# EAGLE design bpswitch (EAGLE 9.6.2)
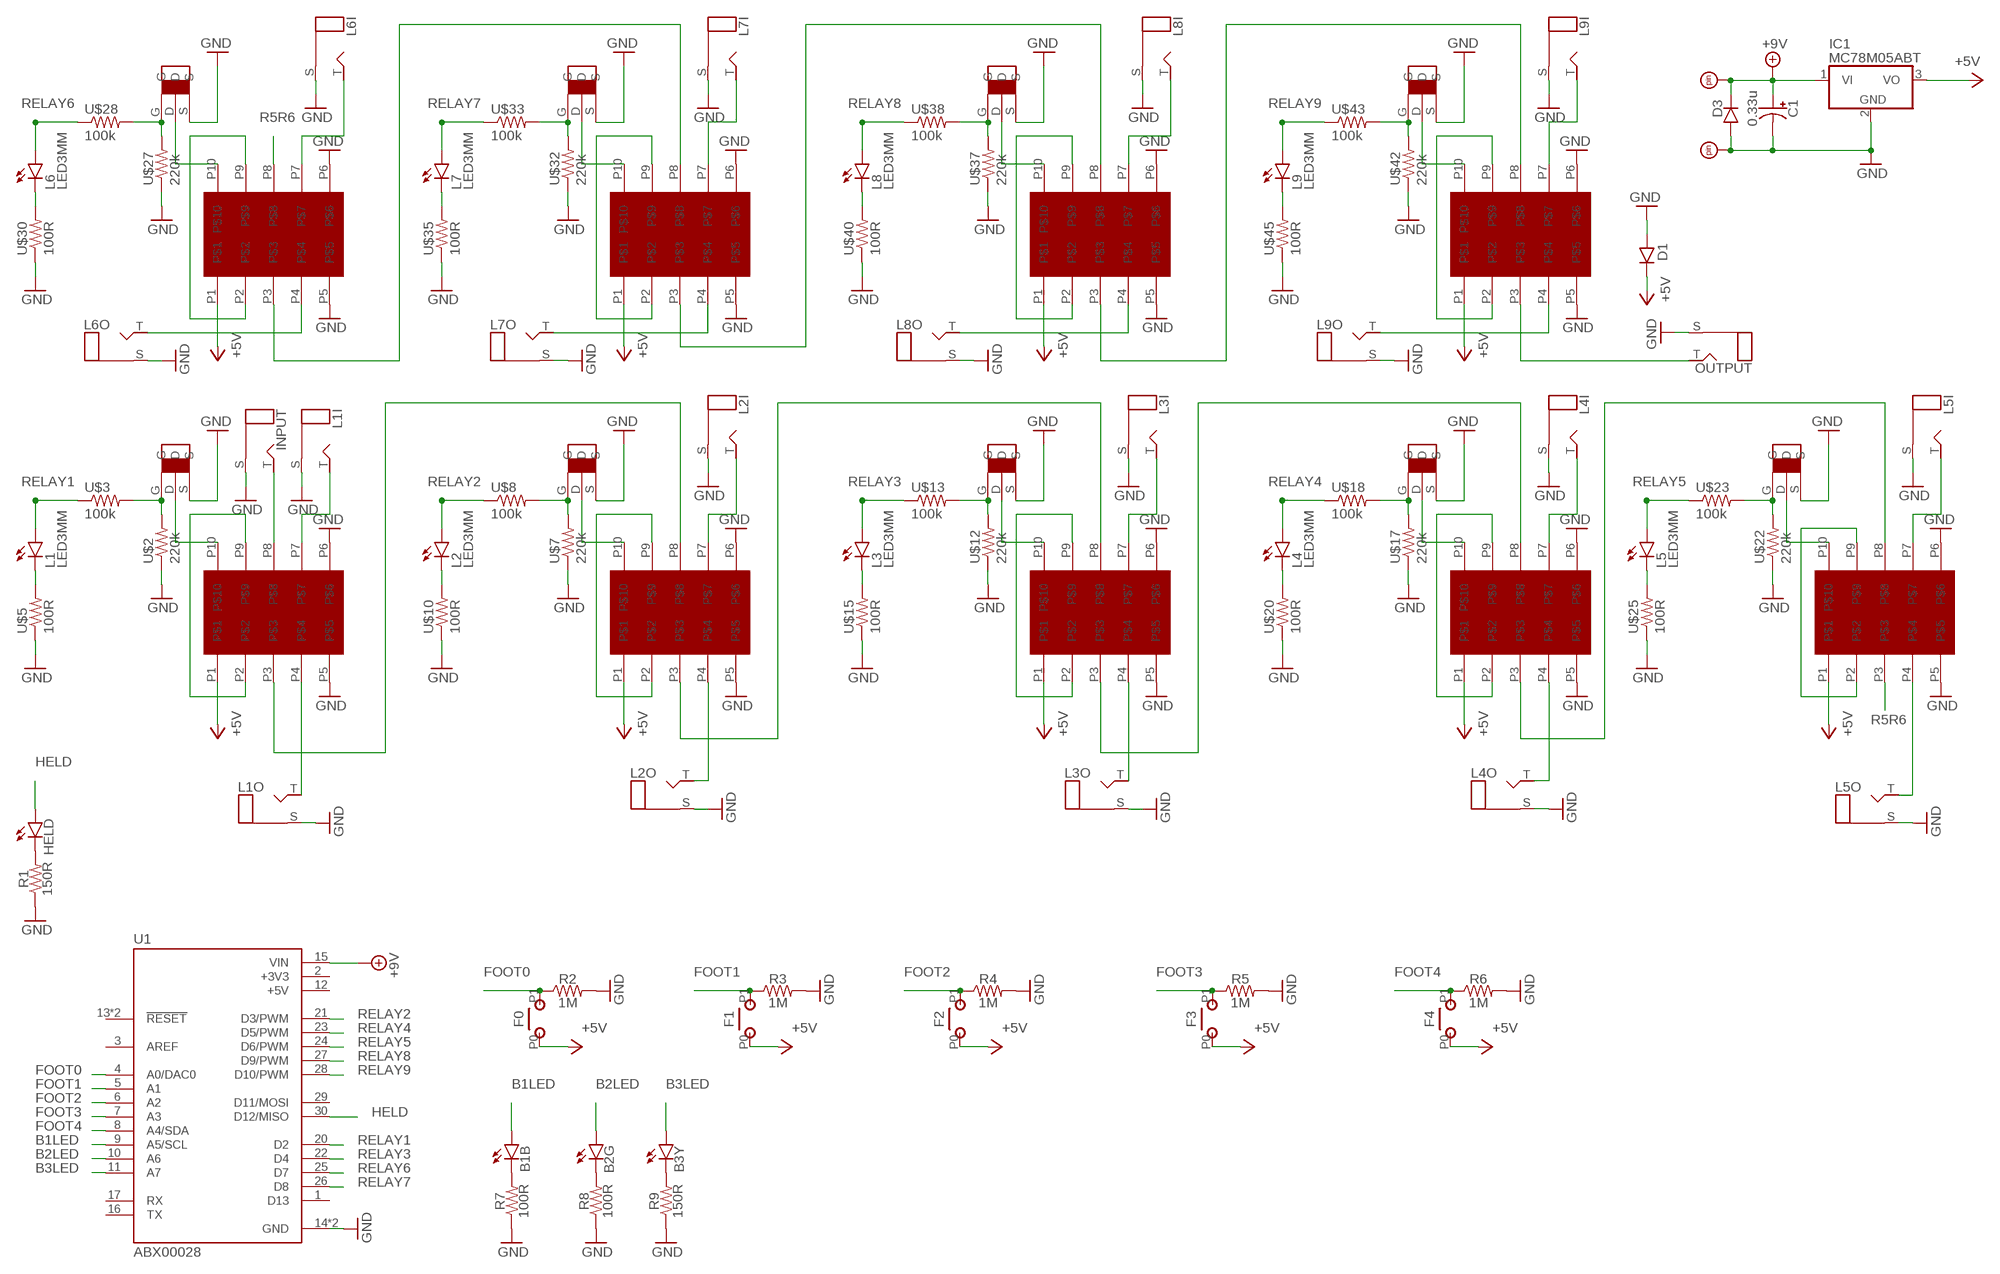
[diagram p0: schematic, sheet 1]

## Parts
B1B  LED.3  [3MM_2]
B2G  LED.3  [3MM_2]
B3Y  LED.3  [3MM_2]
C1  0.33u  5MM.8  [050.FLAT]
D1  1N400X.3  [DO41-3]
D3  DO41.2  [DO41-2]
F0  MOM  [MOM]
F1  MOM  [MOM]
F2  MOM  [MOM]
F3  MOM  [MOM]
F4  MOM  [MOM]
HELD  LED.3  [3MM_2]
IC1  MC78M05ABT  [TO220V]
INPUT  MONO_PADS  [2PADS]
L1  LED3MM  [LED3MM]
L1I  MONO_PADS  [2PADS]
L1O  MONO_PADS  [2PADS]
L2  LED3MM  [LED3MM]
L2I  MONO_PADS  [2PADS]
L2O  MONO_PADS  [2PADS]
L3  LED3MM  [LED3MM]
L3I  MONO_PADS  [2PADS]
L3O  MONO_PADS  [2PADS]
L4  LED3MM  [LED3MM]
L4I  MONO_PADS  [2PADS]
L4O  MONO_PADS  [2PADS]
L5  LED3MM  [LED3MM]
L5I  MONO_PADS  [2PADS]
L5O  MONO_PADS  [2PADS]
L6  LED3MM  [LED3MM]
L6I  MONO_PADS  [2PADS]
L6O  MONO_PADS  [2PADS]
L7  LED3MM  [LED3MM]
L7I  MONO_PADS  [2PADS]
L7O  MONO_PADS  [2PADS]
L8  LED3MM  [LED3MM]
L8I  MONO_PADS  [2PADS]
L8O  MONO_PADS  [2PADS]
L9  LED3MM  [LED3MM]
L9I  MONO_PADS  [2PADS]
L9O  MONO_PADS  [2PADS]
OUTPUT  MONO_PADS  [2PADS]
R1  150R  R.2  [0.2"]
R2  1M  R.2  [0.2"]
R3  1M  R.2  [0.2"]
R4  1M  R.2  [0.2"]
R5  1M  R.2  [0.2"]
R6  1M  R.2  [0.2"]
R7  100R  R.2  [0.2"]
R8  100R  R.2  [0.2"]
R9  150R  R.2  [0.2"]
U1  ABX00028  [MODULE_ABX00028]
U$1  TO-220  [TO-220]
U$2  220k  3MM.2  [R0204/2]
U$3  100k  3MM.2  [R0204/2]
U$4  MINI_RELAY_10PIN  [MINI_RELAY_10PIN]
U$5  100R  3MM.2  [R0204/2]
U$6  TO-220  [TO-220]
U$7  220k  3MM.2  [R0204/2]
U$8  100k  3MM.2  [R0204/2]
U$9  MINI_RELAY_10PIN  [MINI_RELAY_10PIN]
U$10  100R  3MM.2  [R0204/2]
U$11  TO-220  [TO-220]
U$12  220k  3MM.2  [R0204/2]
U$13  100k  3MM.2  [R0204/2]
U$14  MINI_RELAY_10PIN  [MINI_RELAY_10PIN]
U$15  100R  3MM.2  [R0204/2]
U$16  TO-220  [TO-220]
U$17  220k  3MM.2  [R0204/2]
U$18  100k  3MM.2  [R0204/2]
U$19  MINI_RELAY_10PIN  [MINI_RELAY_10PIN]
U$20  100R  3MM.2  [R0204/2]
U$21  TO-220  [TO-220]
U$22  220k  3MM.2  [R0204/2]
U$23  100k  3MM.2  [R0204/2]
U$24  MINI_RELAY_10PIN  [MINI_RELAY_10PIN]
U$25  100R  3MM.2  [R0204/2]
U$26  TO-220  [TO-220]
U$27  220k  3MM.2  [R0204/2]
U$28  100k  3MM.2  [R0204/2]
U$29  MINI_RELAY_10PIN  [MINI_RELAY_10PIN]
U$30  100R  3MM.2  [R0204/2]
U$31  TO-220  [TO-220]
U$32  220k  3MM.2  [R0204/2]
U$33  100k  3MM.2  [R0204/2]
U$34  MINI_RELAY_10PIN  [MINI_RELAY_10PIN]
U$35  100R  3MM.2  [R0204/2]
U$36  TO-220  [TO-220]
U$37  220k  3MM.2  [R0204/2]
U$38  100k  3MM.2  [R0204/2]
U$39  MINI_RELAY_10PIN  [MINI_RELAY_10PIN]
U$40  100R  3MM.2  [R0204/2]
U$41  TO-220  [TO-220]
U$42  220k  3MM.2  [R0204/2]
U$43  100k  3MM.2  [R0204/2]
U$44  MINI_RELAY_10PIN  [MINI_RELAY_10PIN]
U$45  100R  3MM.2  [R0204/2]
VI  PADS.SQR_LBL  [PAD3]
VO  PADS.SQR_LBL  [PAD3]

## Nets
+5V: D1.C F0.P0(P) F1.P0(P) F2.P0(P) F3.P0(P) F4.P0(P) IC1.3(VO) U$4.P1 U$9.P1 U$14.P1 U$19.P1 U$24.P1 U$29.P1 U$34.P1 U$39.P1 U$44.P1
+9V: C1.+ D3.C IC1.1(VI) U1.15(VIN) VI.1
B1LED: B1B.ANODE(A) U1.9(A5/SCL)
B2LED: B2G.ANODE(A) U1.10(A6)
B3LED: B3Y.ANODE(A) U1.11(A7)
FOOT0: F0.P1(S) R2.1 U1.4(A0/DAC0)
FOOT1: F1.P1(S) R3.1 U1.5(A1)
FOOT2: F2.P1(S) R4.1 U1.6(A2)
FOOT3: F3.P1(S) R5.1 U1.7(A3)
FOOT4: F4.P1(S) R6.1 U1.8(A4/SDA)
GND: C1.- D1.A D3.A IC1.2(GND) INPUT.S L1I.S L1O.S L2I.S L2O.S L3I.S L3O.S L4I.S L4O.S L5I.S L5O.S L6I.S L6O.S L7I.S L7O.S L8I.S L8O.S L9I.S L9O.S OUTPUT.S R1.1 R2.2 R3.2 R4.2 R5.2 R6.2 R7.1 R8.1 R9.1 U1.14(GND) U1.19(GND) U$1.S U$2.1 U$4.P5 U$4.P6 U$5.1 U$6.S U$7.1 U$9.P5 U$9.P6 U$10.1 U$11.S U$12.1 U$14.P5 U$14.P6 U$15.1 U$16.S U$17.1 U$19.P5 U$19.P6 U$20.1 U$21.S U$22.1 U$24.P5 U$24.P6 U$25.1 U$26.S U$27.1 U$29.P5 U$29.P6 U$30.1 U$31.S U$32.1 U$34.P5 U$34.P6 U$35.1 U$36.S U$37.1 U$39.P5 U$39.P6 U$40.1 U$41.S U$42.1 U$44.P5 U$44.P6 U$45.1 VO.1
HELD: HELD.ANODE(A) U1.30(D12/MISO)
N$1: U$1.G U$2.2 U$3.2
N$2: U$1.D U$4.P10
N$3: U$6.G U$7.2 U$8.2
N$4: L1.K(C) U$5.2
N$5: U$6.D U$9.P10
N$6: L2.K(C) U$10.2
N$7: U$11.G U$12.2 U$13.2
N$8: U$11.D U$14.P10
N$9: L3.K(C) U$15.2
N$10: U$16.G U$17.2 U$18.2
N$11: U$16.D U$19.P10
N$12: L4.K(C) U$20.2
N$13: U$21.G U$22.2 U$23.2
N$14: U$21.D U$24.P10
N$15: L5.K(C) U$25.2
N$16: U$26.G U$27.2 U$28.2
N$17: U$26.D U$29.P10
N$18: L6.K(C) U$30.2
N$19: U$31.G U$32.2 U$33.2
N$20: U$31.D U$34.P10
N$21: L7.K(C) U$35.2
N$22: U$36.G U$37.2 U$38.2
N$23: U$36.D U$39.P10
N$24: L8.K(C) U$40.2
N$25: U$41.G U$42.2 U$43.2
N$26: U$41.D U$44.P10
N$27: L9.K(C) U$45.2
N$28: U$4.P2 U$4.P9
N$29: U$9.P2 U$9.P9
N$30: U$14.P2 U$14.P9
N$31: U$19.P2 U$19.P9
N$32: U$24.P2 U$24.P9
N$33: U$44.P2 U$44.P9
N$34: U$39.P2 U$39.P9
N$35: U$34.P2 U$34.P9
N$36: U$29.P2 U$29.P9
N$37: U$4.P3 U$9.P8
N$38: U$9.P3 U$14.P8
N$39: U$14.P3 U$19.P8
N$40: U$19.P3 U$24.P8
N$41: U$29.P3 U$34.P8
N$42: U$34.P3 U$39.P8
N$43: U$39.P3 U$44.P8
N$44: L1I.T U$4.P7
N$45: INPUT.T U$4.P8
N$46: L1O.T U$4.P4
N$47: L6O.T U$29.P4
N$48: L6I.T U$29.P7
N$49: L7O.T U$34.P4
N$50: L7I.T U$34.P7
N$51: L8O.T U$39.P4
N$52: L8I.T U$39.P7
N$53: L9I.T U$44.P7
N$54: L9O.T U$44.P4
N$55: OUTPUT.T U$44.P3
N$56: L5I.T U$24.P7
N$57: L5O.T U$24.P4
N$58: L4O.T U$19.P4
N$59: L3O.T U$14.P4
N$60: L3I.T U$14.P7
N$61: L2I.T U$9.P7
N$62: L2O.T U$9.P4
N$63: L4I.T U$19.P7
N$64: HELD.P$1(C) R1.2
N$65: B1B.P$1(C) R7.2
N$66: B2G.P$1(C) R8.2
N$67: B3Y.P$1(C) R9.2
R5R6: U$24.P3 U$29.P8
RELAY1: L1.A U1.20(D2) U$3.1
RELAY2: L2.A U1.21(D3/PWM) U$8.1
RELAY3: L3.A U1.22(D4) U$13.1
RELAY4: L4.A U1.23(D5/PWM) U$18.1
RELAY5: L5.A U1.24(D6/PWM) U$23.1
RELAY6: L6.A U1.25(D7) U$28.1
RELAY7: L7.A U1.26(D8) U$33.1
RELAY8: L8.A U1.27(D9/PWM) U$38.1
RELAY9: L9.A U1.28(D10/PWM) U$43.1
Unconnected: U1.1(D13) U1.3(AREF) U1.13(!RESET) U1.16(TX) U1.17(RX) U1.18(!RESET) U1.29(D11/MOSI)

## Power pins joined to a net without a drawn wire
+3V3: U1.2(+3V3)
+5V: U1.12(+5V)

## Library data of the parts
B1B B2G B3Y HELD = diodes:LED: LEDs, all sizes 3mm: http://smallbear-electronics.mybigcommerce.com/led-t-1-3mm-diffused-colors/ 5mm: http://smallbear-electronics.mybigcommerce.com/led-t-1-3-4-5mm-diffused/
C1 = caps-elec:5MM: 5mm diameter caps Up to 47uF
D1 = gm-diodes:1N400X: Rectifier Diodes often used in power supply to prevent damage from reverse polarization
D3 = diodes:DO41: 1N400x, 1N5817 Standard and Schottky Rectifiers, DO-41 Package 1N4001: http://smallbear-electronics.mybigcommerce.com/diode-1n4001/ 1N5817: http://www.mouser.com/ProductDetail/Fairchild-Semiconductor/1N5817/?qs=sGAEpiMZZMtQ8nqTKtFS%2fCJFZUIIOyzjWJhH2RQmKoY%3d
F0 F1-F4 = dlibland:MOM
IC1 = linear:MC78M: 500 mA Positive Voltage Regulators Source: Data sheet <http://www.onsemi.com/pub_link/Collateral/MC78M00-D.PDF>
INPUT L1I L1O L2I L2O L3I L3O L4I L4O L5I L5O L6I L6O L7I L7O L8I L8O L9I L9O OUTPUT = jacks:MONO: Mono 1/4" TS Jack and wiring connections Marshall style (PCB Mount): http://smallbear-electronics.mybigcommerce.com/1-4-enclosed-nmj4hcd2/ Lumberg Mono (wired): http://smallbear-electronics.mybigcommerce.com/lumberg-1-4-compact-shrouded-mono-jack/
L1-L9 = gm-diodes:LED
R1-R9 = resistors:R: 1/8W, 1/4W and 1W resistors
U1 = ABX00028:ABX00028: ATmega4809 Arduino Nano Every AVR AVR MCU 8-Bit Embedded Evaluation Board; DESCRIPTION: Arduino’s 5V compatible board in the smallest available form factor: 45x18mm!; MF: Arduino; MP: Arduino Nano Every; PACKAGE: None; PURCHASE-URL: https://pricing.snapeda.com/search/part/Arduino Nano Every/?ref=eda
U$1 U$6 U$11 U$16 U$21 U$26 U$31 U$36 U$41 = dlibland:TO-220
U$2 U$3 U$5 U$7 U$8 U$10 U$12 U$13 U$15 U$17 U$18 U$20 U$22 U$23 U$25 U$27 U$28 U$30 U$32 U$33 U$35 U$37 U$38 U$40 U$42 U$43 U$45 = gm-resistors:3MM: 3mm Resistors Leads spaced 1-6 holes apart for 0.1" perfboard. Suitable for 1/8 watt resistors.
U$4 U$9 U$14 U$19 U$24 U$29 U$34 U$39 U$44 = dlibland:MINI_RELAY_10PIN
VI VO = supply pins:PADS.: Pads For I/O connections or test point pads on PCBs.

## Board
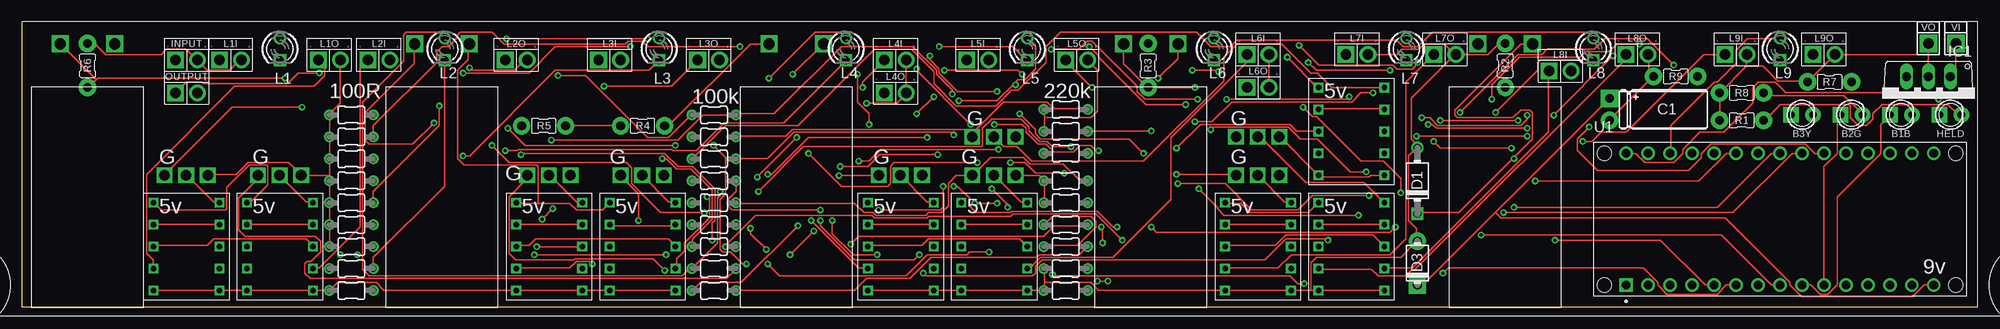
[diagram p1: board, top side]
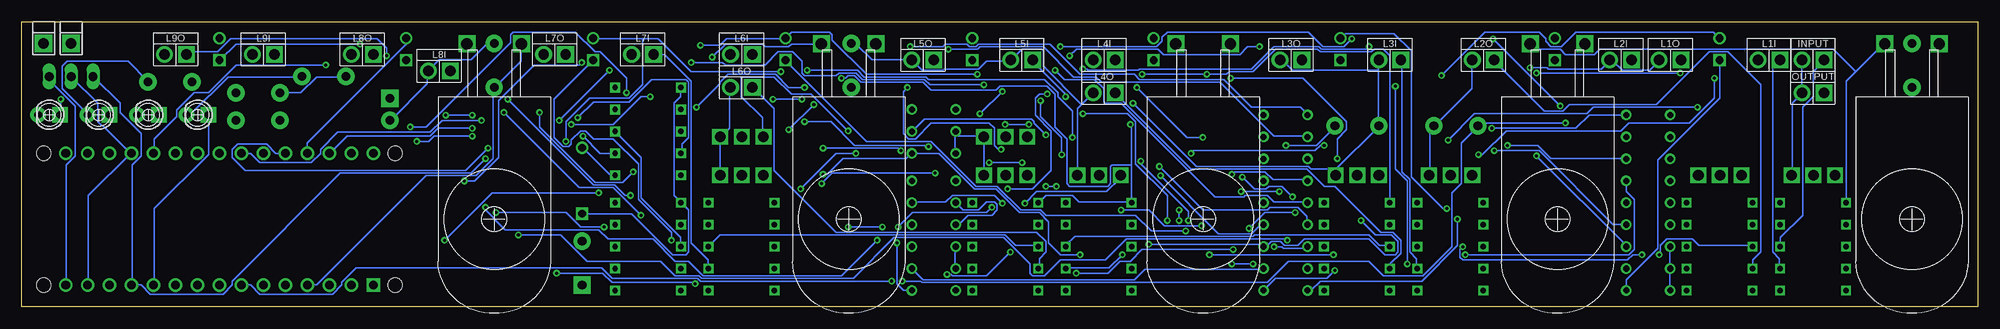
[diagram p2: board, bottom side, seen from below]

Size 226.06 x 33.02 mm. Coordinates in mm from the lower left corner, seen from the top.
Outline: 0,0 226.06,0 226.06,33.02 0,33.02 0,0
Copper layers (1*16): Top 0.035mm / dielectric 1.5mm / Bottom 0.035mm
Design rules "default": minimum track width 6mil, minimum drill 0.35mm, track to track 6mil, track to pad 6mil, pad to pad 6mil, via to via 6mil, smd to smd 6mil, copper to edge 40mil, drill to drill 6mil, minimum pad ring 10mil, minimum via ring 8mil, stop-mask expansion 4mil, vias tented up to drill 0mil, thermal gap 10mil

### Footprints (pad centres in the part's own frame; a part is rotated, then mirrored left to right if it is on the bottom)
3MM_2 = drill 0.9 pad 1.778 square: ANODE -1.27,0 | drill 0.9 pad 1.778: P$1 1.27,0
050.FLAT = drill 1 pad 2 square: + -5.08,1.27 | drill 1 pad 2: - -5.08,-1.27
DO41-3 = drill 0.9: A 3.81,0 | drill 0.9 square: C -3.81,0
DO41-2 = drill 1 pad 2: A 2.54,0 | drill 1 pad 2 square: C -2.54,0
MOM = drill 1.3 square: P0 -3.15,-17.75; P1 3.15,-17.75
TO220V = drill 1.016 long: 1 -2.54,-2.54; 2 0,-2.54; 3 2.54,-2.54
2PADS = drill 1.2 pad 1.93: S 1.27,0 | drill 1.2 pad 1.93 square: T -1.27,0
LED3MM = drill 0.9: A -1.27,0 | drill 0.9 square: K 1.27,0
0.2" = drill 1 pad 2: 1 -2.54,0; 2 2.54,0
MODULE_ABX00028 = drill 1.016 square: 1 -17.78,-7.62 | drill 1.016: 2 -15.24,-7.62; 3 -12.7,-7.62; 4 -10.16,-7.62; 5 -7.62,-7.62; 6 -5.08,-7.62; 7 -2.54,-7.62; 8 0,-7.62; 9 2.54,-7.62; 10 5.08,-7.62; 11 7.62,-7.62; 12 10.16,-7.62; 13 12.7,-7.62; 14 15.24,-7.62; 15 17.78,-7.62; 16 17.78,7.62; 17 15.24,7.62; 18 12.7,7.62; 19 10.16,7.62; 20 7.62,7.62; 21 5.08,7.62; 22 2.54,7.62; 23 0,7.62; 24 -2.54,7.62; 25 -5.08,7.62; 26 -7.62,7.62; 27 -10.16,7.62; 28 -12.7,7.62; 29 -15.24,7.62; 30 -17.78,7.62 | hole 1.651: -20.32,-7.62; -20.32,7.62; 20.32,7.62; 20.32,-7.62
TO-220 = drill 1.219 square: D -0.04,0; G -2.54,0; S 2.46,0
R0204/2 = drill 0.7: 1 -2.54,0; 2 2.54,0
MINI_RELAY_10PIN = drill 0.635 square: P1 -3.81,5.08; P2 -3.81,2.54; P3 -3.81,0; P4 -3.81,-2.54; P5 -3.81,-5.08; P6 3.81,-5.08; P7 3.81,-2.54; P8 3.81,0; P9 3.81,2.54; P10 3.81,5.08
PAD3 = drill 1.2 pad 2.032 square: 1 0,0

### Placement (x,y rotation side)
B1B  217.17,22.23 0 top
B2G  211.45,22.23 0 top
B3Y  205.74,22.23 0 top
C1  188.59,22.86 0 top
D1  161.29,14.61 90 top
D3  161.29,5.08 90 top
F0  171.45,12.7 180 top
F1  130.49,12.7 180 top
F2  89.53,12.7 180 top
F3  48.58,12.7 180 top
F4  7.62,12.7 180 top
HELD  222.88,22.23 0 top
IC1  220.34,24.13 180 top
INPUT  19.05,28.57 0 top
L1  29.84,29.85 270 top
L1I  24.13,28.57 0 top
L1O  35.56,28.57 0 top
L2  48.89,29.85 270 top
L2I  41.28,28.57 0 top
L2O  57.15,28.57 0 top
L3  73.66,29.85 270 top
L3I  67.94,28.57 0 top
L3O  79.38,28.57 0 top
L4  95.25,29.85 270 top
L4I  100.97,28.57 0 top
L4O  100.97,24.77 0 top
L5  116.2,29.85 270 top
L5I  110.49,28.57 0 top
L5O  121.92,28.57 0 top
L6  137.8,29.85 270 top
L6I  142.88,29.21 0 top
L6O  142.88,25.4 0 top
L7  160.02,29.85 270 top
L7I  154.31,29.21 0 top
L7O  164.47,29.21 0 top
L8  181.61,29.85 270 top
L8I  177.8,27.3 0 top
L8O  186.69,29.21 0 top
L9  203.2,29.85 270 top
L9I  198.12,29.21 0 top
L9O  208.28,29.21 0 top
OUTPUT  19.05,24.77 0 top
R1  198.75,21.59 0 top
R2  171.45,27.94 90 top
R3  130.18,27.94 90 top
R4  71.75,20.95 180 top
R5  60.33,20.95 0 top
R6  7.62,27.94 90 top
R7  208.92,26.04 0 top
R8  198.75,24.77 0 top
R9  191.13,26.67 0 top
U1  203.2,10.16 0 top
U$1  19.05,15.24 0 top
U$2  120.65,1.91 0 top
U$3  80.01,22.23 0 top
U$4  19.05,6.98 0 top
U$5  38.1,1.91 0 top
U$6  29.84,15.24 0 top
U$7  120.65,4.45 0 top
U$8  80.01,4.45 0 top
U$9  29.84,6.98 0 top
U$10  38.1,4.45 0 top
U$11  60.96,15.24 0 top
U$12  120.65,6.98 0 top
U$13  80.01,1.91 0 top
U$14  60.96,6.98 0 top
U$15  38.1,6.98 0 top
U$16  71.75,15.24 0 top
U$17  120.65,9.53 0 top
U$18  80.01,6.98 0 top
U$19  71.75,6.98 0 top
U$20  38.1,9.53 0 top
U$21  101.6,15.24 0 top
U$22  120.65,12.07 0 top
U$23  80.01,9.53 0 top
U$24  101.6,6.98 0 top
U$25  38.1,12.07 0 top
U$26  112.39,15.24 0 top
U$27  120.65,14.61 0 top
U$28  80.01,12.07 0 top
U$29  112.39,6.98 0 top
U$30  38.1,14.61 0 top
U$31  142.88,15.24 0 top
U$32  120.65,17.78 0 top
U$33  80.01,14.61 0 top
U$34  142.88,6.98 0 top
U$35  38.1,17.15 0 top
U$36  142.88,19.69 0 top
U$37  120.65,20.32 0 top
U$38  80.01,17.15 0 top
U$39  153.67,6.98 0 top
U$40  38.1,19.69 0 top
U$41  112.39,19.69 0 top
U$42  120.65,22.86 0 top
U$43  80.01,19.69 0 top
U$44  153.67,20.32 0 top
U$45  38.1,22.23 0 top
U$46  [1032L]  113.03,29.21 0 top
U$47  [LUMBURG_TOP]  29.36,58.42 0 bottom  (outside the outline)
U$48  [LUMBURG_TOP]  203.2,58.42 0 bottom  (outside the outline)
U$49  [LUMBURG_TOP]  159.74,58.42 0 bottom  (outside the outline)
U$50  [LUMBURG_TOP]  138,58.42 0 bottom  (outside the outline)
U$51  [LUMBURG_TOP]  116.28,58.42 0 bottom  (outside the outline)
U$52  [LUMBURG_TOP]  94.54,58.42 0 bottom  (outside the outline)
U$53  [LUMBURG_TOP]  72.82,58.42 0 bottom  (outside the outline)
U$54  [LUMBURG_TOP]  51.1,58.42 0 bottom  (outside the outline)
U$55  [LUMBURG_TOP]  7.62,58.42 0 bottom  (outside the outline)
U$56  [DC_TOP]  219.71,63.5 0 top  (outside the outline)
U$57  [LUMBURG_TOP]  181.48,58.42 0 bottom  (outside the outline)
U$58  [MOMENTARY]  171.45,10.16 270 top
U$59  [MOMENTARY]  130.49,10.16 270 top
U$60  [MOMENTARY]  89.53,10.16 270 top
U$61  [MOMENTARY]  48.58,10.16 270 top
U$62  [MOMENTARY]  7.62,10.16 270 top
VI  223.52,30.48 180 top
VO  220.34,30.48 180 top

### Tracks (layer width: path | path; a pad name or v marks a point on that pad's centre or on a via)
+5V  (via drill 0.35)
  Top 0.152: U$34.P1 139.09,11.99 140.92,11.99 141.99,10.92 148.69,10.92 149.76,11.99 U$39.P1 | v146.25,28.91 149.76,25.4 U$44.P1 | 172.31,17.17 166.06,10.92 161.34,10.92 D1.C | 172.31,17.17 174.6,19.46 174.6,22.5 174.3,22.81 173.23,22.81 172.31,21.89 165.91,21.89 165.61,22.2 165.61,22.81 173.23,30.43 174.6,30.43 F0.P0 | 172.31,17.17 v172.47,17.17 | U$9.P1 26.16,12.14 26.47,12.14 28.45,14.12 28.45,16.26 28.3,16.41 26.31,16.41 23.72,13.82 23.72,11.38 23.57,11.23 16.1,11.23 15.34,11.99 U$4.P1 | 59.69,11.99 63.35,11.99 64.11,11.23 67.16,11.23 67.92,11.99 U$19.P1 | 59.69,11.99 57.25,11.99 U$14.P1 | 59.69,11.99 59.69,16.26 59.54,16.41 51.16,16.41 50.39,17.17 50.39,27.38 51.61,28.6 51.61,30.43 F3.P0 | v89.1,26.92 92.61,30.43 F2.P0 | v97.94,21.13 97.94,22.35 96.57,23.72 v96.57,26.92 | v131.32,26.47 133.6,28.75 133.6,30.43 F1.P0
  Bottom 0.152: 213.31,2.54 213.31,16.41 212.24,17.48 212.24,20.07 214.68,22.5 214.68,23.57 217.73,26.62 IC1.3 | U$44.P1 149.91,25.4 149.91,24.33 150.67,23.57 150.67,12.9 149.91,12.14 U$39.P1 149.76,11.99 149,11.23 149,6.35 149.3,6.05 150.82,6.05 155.55,10.77 161.19,10.77 D1.C | v146.25,28.91 144.73,30.43 140.46,30.43 140.16,30.12 137.41,30.12 137.11,30.43 133.76,30.43 F1.P0 | 213.31,2.54 212.24,2.54 211.18,1.47 202.79,1.47 201.73,2.54 201.73,3 189.23,15.49 174.14,15.49 v172.47,17.17 | 213.31,2.54 U1.12 | 14.12,27.23 10.92,30.43 F4.P0 | 14.12,27.23 15.19,26.16 15.19,12.14 U$4.P1 | 97.79,12.14 103.89,12.14 104.65,12.9 107.7,12.9 108.46,12.14 U$29.P1 | U$19.P1 67.92,12.14 67.92,29.06 68.68,29.82 69.75,29.82 70.05,29.52 76,29.52 76.3,29.82 81.18,29.82 83.77,27.23 86.51,27.23 86.82,26.92 v89.1,26.92 v96.57,26.92 | 97.79,16.41 97.79,20.98 v97.94,21.13 | 97.79,16.41 97.79,12.14 | 97.79,12.14 U$24.P1 | 14.12,27.23 16.71,29.82 43.69,29.82 44.3,29.21 47.65,29.21 48.26,29.82 51,29.82 51.61,30.43 F3.P0 | v131.32,26.47 130.86,26.47 130.56,26.77 129.79,26.77 129.03,26.01 121.87,26.01 120.95,25.09 113.49,25.09 113.03,25.55 107.54,25.55 106.63,24.64 106.63,20.83 105.26,19.46 105.26,14.28 104.95,13.97 100.53,13.97 100.23,14.28 100.23,16.26 100.08,16.41 97.79,16.41
+9V
  Top 0.152: VI.1 223.52,27.38 222.91,26.77 IC1.1 | D3.C 161.95,2.54 170.33,10.92 | 170.33,10.92 183.44,24.03 C1.+ | U1.15 219.86,2.54 218.49,1.17 205.69,1.17 204.32,2.54 204.32,2.85 196.85,10.31 170.94,10.31 170.33,10.92
  Bottom 0.152: U1.15 220.93,2.54 220.93,16.41 219.86,17.48 219.86,23.27 222.76,26.16 222.76,26.62 IC1.1
B1LED
  Top 0.152: U1.9 206.76,2.54 207.82,1.47 208.74,1.47 209.8,2.54 209.8,12.75 214.83,17.78 214.83,21.13 215.9,22.2 B1B.ANODE
B2LED
  Top 0.152: U1.10 208.28,16.26 209.8,17.78 209.8,21.89 210.11,22.2 B2G.ANODE
B3LED
  Bottom 0.152: B3Y.ANODE 204.47,17.63 210.72,11.38 210.72,2.54 U1.11
FOOT0
  Bottom 0.152: U1.4 191.97,2.54 179.32,15.19 173.53,15.19 171.55,17.17 171.55,25.4 R2.1 171.4,25.4 168.35,28.45 168.35,30.43 F0.P1
FOOT1  (via drill 0.35)
  Top 0.152: U1.5 194.56,2.54 189.38,7.72 v177.19,7.72 | v159.36,13.21 159.36,14.88 157.38,16.87 154.79,16.87 149.61,22.05 149.15,22.05 v148.08,23.11 | v135.59,25.4 R3.1 130.1,25.4 127.36,28.14 127.36,30.43 F1.P1
  Bottom 0.152: v177.19,7.72 171.7,13.21 v159.36,13.21 | v148.08,23.11 145.34,25.86 145.34,26.01 144.42,26.92 138.94,26.92 137.41,25.4 v135.59,25.4
FOOT2  (via drill 0.35)
  Top 0.152: U1.6 197,2.54 195.94,1.47 190.14,1.47 189.08,2.54 189.08,2.85 187.4,4.52 164.85,4.52 v164.24,3.91 | v148.23,2.69 147.47,2.69 146.56,3.61 119.28,3.61 v119.13,3.76 | v111.81,6.35 109.53,6.35 109.22,6.05 104.65,6.05 102.21,3.61 87.58,3.61 v86.21,4.98 | v83.77,4.98 83.31,4.98 81.94,6.35 81.03,6.35 80.72,6.66 80.72,12.45 81.33,13.06 81.33,17.32 v79.96,18.69 | F2.P1 86.36,30.43 84.23,30.43 74.78,20.98 74.32,20.98 R4.1
  Bottom 0.152: v164.24,3.91 158.9,3.91 157.84,2.85 148.39,2.85 v148.23,2.69 | v119.13,3.76 118.67,3.76 118.52,3.61 114.55,3.61 v111.81,6.35 | v83.77,4.98 v86.21,4.98 | v79.96,18.69 76.45,18.69 74.32,20.83 R4.1
FOOT3  (via drill 0.35)
  Top 0.152: v124.31,3 v125.53,3 | v47.65,21.29 45.21,18.85 40.18,18.85 39.73,19.3 39.73,22.5 45.36,28.14 45.36,30.43 F3.P1
  Bottom 0.152: U1.7 199.59,2.54 198.53,1.47 190.14,1.47 189.08,2.54 189.08,2.85 187.4,4.52 159.06,4.52 157.84,3.3 147.93,3.3 147.62,3 v125.53,3 | v124.31,3 122.17,3 122.02,2.85 82.09,2.85 79.65,5.28 70.36,5.28 68.68,3.61 64.11,3.61 60.76,6.96 60.76,13.21 59.69,14.28 59.69,19 57.86,20.83 R5.1 57.71,20.98 57.4,21.29 v47.65,21.29
FOOT4  (via drill 0.35)
  Top 0.152: U1.8 202.18,2.54 196.39,8.33 v168.66,8.33 | v79.81,7.72 79.81,9.7 80.11,10.01 80.11,13.67 77.52,16.26 75.84,16.26 74.32,17.78 57.86,17.78 v57.71,17.63 | v30.43,26.47 8.79,26.47 8.64,26.31 | 8.64,26.31 7.72,25.4 R6.1 | 8.64,26.31 4.52,30.43 F4.P1
  Bottom 0.152: v168.66,8.33 163.78,8.33 160.73,5.28 152.2,5.28 150.52,3.61 147.78,3.61 147.47,3.3 129.95,3.3 125.22,8.03 112.57,8.03 109.53,4.98 109.53,3.91 109.22,3.61 107.85,3.61 106.02,5.44 100.84,5.44 98.4,7.87 79.96,7.87 v79.81,7.72 | v57.71,17.63 57.25,17.63 54.51,20.37 41.25,20.37 40.34,21.29 33.33,21.29 30.43,24.18 v30.43,26.47
GND  (via drill 0.35)
  Top 0.152: R5.2 62.89,20.98 69.14,20.98 R4.2 | L1I.S 25.4,28.45 25.09,28.45 24.03,27.38 21.44,27.38 20.37,28.45 INPUT.S 20.22,28.6 19,29.82 16.71,29.82 16.1,29.21 9.7,29.21 8.48,30.43 7.72,30.43 R6.2 | U$19.P6 75.54,1.93 68.07,1.93 U$19.P5 67.92,1.93 64.87,1.93 U$14.P6 64.72,1.93 57.25,1.93 U$14.P5 57.1,1.93 41.86,1.93 40.95,2.85 36.53,2.85 35.61,1.93 U$5.1 35.46,1.93 33.78,1.93 U$9.P6 33.63,1.93 26.16,1.93 U$9.P5 26.01,1.93 22.96,1.93 U$4.P6 22.81,1.93 15.34,1.93 U$4.P5 | U$15.1 35.61,7.11 35.61,9.4 U$20.1 35.61,9.55 35.61,11.99 U$25.1 35.61,12.14 35.61,14.58 U$30.1 | 35.61,15.19 35.61,14.73 U$30.1 | 35.61,15.19 35.61,17.02 U$35.1 35.61,17.17 35.61,19.61 U$40.1 35.61,19.76 35.61,22.2 U$45.1 35.61,22.35 36.83,23.57 L1O.S | 35.61,15.19 32.41,15.19 U$6.S 32.26,15.34 30.89,16.71 26.16,16.71 24.79,15.34 21.59,15.34 U$1.S | 35.61,15.19 U$30.1 | v51.77,27.69 52.07,27.38 56.95,27.38 58.01,28.45 58.32,28.45 L2O.S | 118.21,2.85 118.21,4.37 U$7.1 | 118.21,2.85 118.21,1.93 U$2.1 118.06,1.93 116.23,1.93 U$29.P6 116.08,1.93 108.61,1.93 U$29.P5 108.46,1.93 105.41,1.93 | 105.41,1.93 97.79,1.93 U$24.P5 | 105.41,1.93 U$24.P6 | L4I.S 102.21,28.45 102.21,24.79 L4O.S 102.21,24.64 101.14,23.57 v97.64,23.57 | 118.21,21.89 118.21,20.37 U$37.1 | 118.21,21.89 118.21,22.81 U$42.1 | U$22.1 118.21,12.14 118.21,14.58 U$27.1 118.06,14.73 117.6,15.19 114.86,15.19 U$26.S | 118.21,21.89 123.55,21.89 124.31,22.66 124.31,27.38 123.24,28.45 L5O.S | U$12.1 118.21,7.11 122.02,7.11 124.16,9.25 124.16,9.86 123.55,10.46 119.13,10.46 118.21,9.55 U$17.1 | 149,1.93 146.71,1.93 U$34.P6 146.56,1.93 139.09,1.93 U$34.P5 138.94,1.93 124.46,1.93 123.55,2.85 118.21,2.85
  Top 0.152: 149,1.93 149.76,1.93 U$39.P5 149.91,1.93 157.38,1.93 U$39.P6 | L6O.S 144.12,25.4 144.12,29.21 L6I.S | U$36.S 145.34,19.76 U$44.P5 150.06,15.04 155.7,15.04 155.85,15.19 157.38,15.19 U$44.P6 | 149,1.93 149,5.13 149.61,5.74 159.36,5.74 161.19,7.57 D3.A 161.19,7.72 161.19,9.09 160.27,10.01 160.27,17.48 161.19,18.39 D1.A 161.19,18.54 161.19,18.85 160.58,19.46 160.58,24.18 165.61,29.21 | 220.32,29.21 220.32,26.77 IC1.2 | 220.32,29.21 220.32,30.43 VO.1 | L7I.S 158.9,29.21 159.51,29.82 161.49,29.82 162.1,30.43 164.39,30.43 165.61,29.21 | R2.2 171.4,30.43 170.64,30.43 169.42,29.21 L7O.S 165.61,29.21 | L8O.S 188.01,29.21 188.01,27.23 188.47,26.77 R9.1 188.47,26.62 183.44,21.59 C1.- | 199.29,27.84 199.29,29.21 L9I.S | 199.29,27.84 R8.1 196.24,24.64 196.24,21.59 R1.1 | 199.29,27.84 201.27,27.84 202.95,26.16 206.3,26.16 R7.1 206.45,26.16 209.5,29.21 L9O.S 220.32,29.21
  Bottom 0.152: U$11.S 63.35,15.34 63.35,20.37 62.89,20.83 R5.2 62.74,20.98 58.47,25.25 58.47,28.45 L2O.S | 74.17,15.95 74.17,15.34 U$16.S 74.17,15.95 | 74.17,15.95 69.29,20.83 R4.2 69.29,20.98 69.29,27.38 | 69.29,27.38 69.29,28.45 L3I.S | 69.29,27.38 79.2,27.38 80.26,28.45 80.57,28.45 L3O.S | U$1.S 21.44,15.34 21.44,23.57 20.37,24.64 OUTPUT.S 20.37,24.79 20.37,28.45 INPUT.S | U$15.1 35.61,6.96 35.61,4.52 U$10.1 35.61,4.37 35.61,1.93 U$5.1 | L1O.S 36.83,28.45 37.9,27.38 41.1,27.38 42.16,28.45 42.47,28.45 L2I.S 42.62,28.45 43.54,27.53 49.63,27.53 49.78,27.69 v51.77,27.69 | U$7.1 118.21,4.52 118.21,6.96 U$12.1 | L4O.S 103.58,23.42 | 103.58,23.42 104.04,22.96 104.04,15.34 U$21.S | 118.21,19.76 118.21,20.22 U$37.1 118.21,19.76 | 118.21,19.76 118.21,17.78 U$32.1 | 118.21,19.76 114.86,19.76 U$41.S 114.86,19.61 114.86,15.34 U$26.S | U$17.1 118.06,9.55 117.75,9.55 116.69,10.62 113.94,10.62 113.34,11.23 113.34,11.84 113.64,12.14 114.55,12.14 115.47,11.23 117.3,11.23 118.06,11.99 U$22.1 | R3.2 130.1,30.43 129.64,30.43 127.81,28.6 123.24,28.6 L5O.S 123.09,28.45 122.02,27.38 119.58,27.38 119.43,27.53 115.47,27.53 114.55,28.45 111.81,28.45 L5I.S 111.66,28.6 110.44,29.82 108.15,29.82 108,29.67 108,27.84 103.58,23.42 | U$44.P6 157.53,15.34 158.14,15.34 161.19,18.39 D1.A | U$31.S 145.34,15.34 145.34,19.61 U$36.S 145.19,19.76 144.27,20.68 144.27,25.4 L6O.S | 213.46,17.78 216.66,20.98 216.81,20.98 217.27,21.44 217.27,23.57 220.32,26.62 IC1.2 | 213.46,17.78 218.34,12.9 218.34,2.54 U1.14 | 213.46,17.78 U1.19 | C1.- 183.44,21.59 179.17,25.86 179.17,27.23 L8I.S 179.02,27.38 177.8,28.6 174.14,28.6 172.31,30.43 171.55,30.43 R2.2
  Bottom 0.152: R9.1 188.62,26.62 191.97,26.62 193.8,24.79 196.09,24.79 R8.1 | 74.17,15.95 77.06,15.95 77.37,16.26 90.32,16.26 v97.64,23.57
HELD  (via drill 0.35)
  Top 0.152: U1.30 186.49,17.78 187.55,16.71 190.91,16.71 191.97,17.78 191.97,18.24 193.95,20.22 196.7,20.22 200.05,23.57 200.05,25.4 200.66,26.01 202.64,26.01 203.86,24.79 220.78,24.79 v221.54,24.03
  Bottom 0.152: v221.54,24.03 221.54,22.35 HELD.ANODE
N$1  (via drill 0.35)
  Top 0.152: v61.21,19.3 75.84,19.3 78.74,22.2 82.55,22.2 U$3.2 82.55,22.35 86.97,22.35 94.74,30.12 102.97,30.12 105.72,27.38 105.72,26.92 107.54,25.09 v107.54,24.64 | v32.41,23.11 24.33,23.11 16.56,15.34 U$1.G | v124.92,7.42 124.92,9.09 v124.77,9.25 | v113.94,11.53 113.94,11.84 v112.12,13.67
  Bottom 0.152: v61.21,19.3 58.17,22.35 45.21,22.35 44.45,23.11 v32.41,23.11 | v124.92,7.42 124.92,2.69 124.16,1.93 123.24,1.93 U$2.2 | v124.77,9.25 123.09,10.92 114.55,10.92 v113.94,11.53 | v112.12,13.67 109.22,13.67 107.09,15.8 107.09,20.37 108.92,22.2 108.92,24.18 108.46,24.64 v107.54,24.64
N$2
  Top 0.152: U$4.P10 22.81,12.14 22.2,12.14 19.15,15.19 U$1.D
N$3
  Top 0.152: U$6.G 27.23,15.19 27.23,14.73 25.09,12.6 25.09,8.94 25.86,8.18 33.93,8.18 34.54,7.57 34.54,6.35 33.48,5.28 33.02,5.28 32.72,4.98 32.72,3.91 33.33,3.3 81.48,3.3 82.55,4.37 U$8.2
  Bottom 0.152: U$8.2 82.55,4.37 96.27,4.37 97.48,3.15 121.87,3.15 123.09,4.37 U$7.2
N$4
  Bottom 0.152: U$5.2 40.64,3.15 36.98,6.81 36.98,17.02 29.82,24.18 29.82,28.45 L1.K
N$5
  Top 0.152: U$9.P10 33.63,12.14 32.87,12.14 29.82,15.19 U$6.D
N$6
  Top 0.152: U$10.2 40.64,5.74 48.87,13.97 48.87,28.45 L2.K
N$7  (via drill 0.35)
  Top 0.152: U$13.2 82.55,1.93 96.27,1.93 97.64,3.3 102.67,3.3 105.11,5.74 117.3,5.74 117.6,6.05 122.17,6.05 123.09,6.96 U$12.2 | v74.32,4.22 72.95,5.59 63.96,5.59 63.8,5.44 57.1,5.44 56.34,6.2 56.34,12.75 58.32,14.73 58.32,15.19 U$11.G
  Bottom 0.152: v74.32,4.22 75.23,3.3 81.18,3.3 82.55,1.93 U$13.2
N$8
  Top 0.152: U$14.P10 64.72,12.14 64.11,12.14 61.06,15.19 U$11.D
N$9  (via drill 0.35)
  Top 0.152: v51,17.48 51.77,17.48 61.67,27.38 72.49,27.38 73.56,28.45 L3.K
  Bottom 0.152: v51,17.48 40.64,7.11 U$15.2
N$10  (via drill 0.35)
  Top 0.152: v71.27,10.01 71.27,13.06 69.14,15.19 U$16.G | v95.81,7.26 96.72,8.18 118.06,8.18 119.28,9.4 123.09,9.4 U$17.2
  Bottom 0.152: 82.55,7.11 82.09,7.11 81.64,7.57 80.57,7.57 80.11,7.11 78.59,7.11 77.83,7.87 70.36,7.87 68.53,6.05 67.31,6.05 67,6.35 67,7.57 67.77,8.33 69.6,8.33 v71.27,10.01 | v95.81,7.26 82.7,7.26 82.55,7.11 | 82.55,7.11 U$18.2
N$11
  Top 0.152: U$19.P10 75.54,12.14 74.78,12.14 71.73,15.19 U$16.D
N$12  (via drill 0.35)
  Top 0.152: v55.88,18.09 57.25,18.09 57.4,18.24 75.08,18.24 75.23,18.09 77.98,18.09 81.18,21.29 88.04,21.29 95.2,28.45 L4.K
  Bottom 0.152: v55.88,18.09 50.7,18.09 42.16,9.55 40.64,9.55 U$20.2
N$13  (via drill 0.35)
  Top 0.152: v94.44,15.19 99.01,15.19 U$21.G | v110.13,11.99 v112.72,11.99
  Bottom 0.152: v94.44,15.19 87.73,8.48 83.92,8.48 83.01,9.4 82.55,9.4 U$23.2 | v112.72,11.99 113.64,12.9 118.52,12.9 119.28,12.14 123.09,12.14 U$22.2 | v110.13,11.99 108.76,13.36 100.69,13.36 99.16,14.88 99.16,15.19 U$21.G
N$14
  Top 0.152: U$24.P10 105.41,12.14 104.65,12.14 101.6,15.19 U$21.D
N$15  (via drill 0.35)
  Top 0.152: U$25.2 40.64,13.36 48.26,20.98 v48.26,23.27 | v72.34,31.04 v56.03,31.04 | v106.02,30.12 114.55,30.12 116.08,28.6 L5.K
  Bottom 0.152: v56.03,31.04 v48.26,23.27 | v72.34,31.04 73.25,30.12 75.69,30.12 77.37,31.8 93.67,31.8 94.28,31.19 94.28,30.73 94.89,30.12 v106.02,30.12
N$16
  Top 0.152: U$28.2 82.55,11.99 96.27,11.99 97.33,10.92 98.4,10.92 98.7,10.62 104.5,10.62 104.8,10.92 106.32,10.92 107.09,11.68 107.09,14.28 108,15.19 109.83,15.19 U$26.G 109.98,15.34 111.96,17.32 115.77,17.32 116.53,16.56 120.34,16.56 122.17,14.73 123.09,14.73 U$27.2
N$17
  Top 0.152: U$29.P10 116.08,12.14 115.47,12.14 112.42,15.19 U$26.D
N$18  (via drill 0.35)
  Top 0.152: v74.47,6.05 v59.23,6.05 | v91.54,8.79 v88.8,6.05
  Bottom 0.152: U$30.2 40.64,13.36 39.73,12.45 39.73,6.66 40.34,6.05 v59.23,6.05 | v88.8,6.05 v74.47,6.05 | v91.54,8.79 95.5,8.79 97.33,10.62 107.7,10.62 108.31,11.23 110.59,11.23 113.34,13.97 115.77,13.97 120.95,19.15 128.42,19.15 137.72,28.45 L6.K
N$19  (via drill 0.35)
  Top 0.152: U$33.2 82.55,13.36 81.64,12.45 81.64,11.68 82.09,11.23 v92.3,11.23 | v92.3,10.01 92.3,9.4 96.27,5.44 103.12,5.44 v103.73,6.05 | v133.45,15.34 140.31,15.34 U$31.G
  Bottom 0.152: v92.3,10.01 v92.3,11.23 | v103.73,6.05 106.02,6.05 107.39,7.42 107.39,9.86 108.46,10.92 110.74,10.92 113.49,13.67 115.93,13.67 120.04,17.78 U$32.2 123.24,17.78 123.85,17.17 131.17,17.17 132.99,15.34 v133.45,15.34
N$20
  Top 0.152: U$34.P10 146.56,12.14 145.95,12.14 142.9,15.19 U$31.D
N$21  (via drill 0.35)
  Top 0.152: v54.36,18.69 56.34,16.71 69.9,16.71 70.51,16.1 70.51,14.28 73.86,10.92 v78.89,10.92 | v84.23,9.09 84.23,8.48 v86.06,6.66 | v104.19,3.91 104.5,3.61 116.84,3.61 117.14,3.91 117.14,4.67 117.91,5.44 143.66,5.44 146.1,7.87 150.82,7.87 v150.98,7.72
  Bottom 0.152: v54.36,18.69 50.85,18.69 49.33,17.17 40.64,17.17 U$35.2 | v78.89,10.92 82.4,10.92 v84.23,9.09 | v86.06,6.66 96.57,6.66 97.94,5.28 99.16,5.28 100.53,3.91 v104.19,3.91 | v150.98,7.72 150.98,8.64 154.79,12.45 154.79,16.56 157.68,19.46 159.97,19.46 160.88,20.37 161.49,20.37 162.56,19.3 162.56,18.85 162.87,18.54 163.47,18.54 164.54,19.61 164.54,24.03 160.12,28.45 L7.K
N$22  (via drill 0.35)
  Top 0.152: v107.7,19.91 107.39,20.22 89.26,20.22 86.21,17.17 82.55,17.17 U$38.2 | v130.56,20.37 123.24,20.37 U$37.2
  Bottom 0.152: v107.7,19.91 109.07,21.29 109.07,21.44 109.37,21.74 121.72,21.74 123.09,20.37 U$37.2 | v130.56,20.37 134.82,24.64 137.11,24.64 139.09,26.62 142.75,26.62 142.9,26.47 142.9,24.33 140.46,21.89 140.46,19.76 U$36.G
N$23
  Top 0.152: U$39.P10 157.38,12.14 155.09,14.43 148.39,14.43 143.21,19.61 142.9,19.61 U$36.D
N$24  (via drill 0.35)
  Top 0.152: U$40.2 40.64,20.98 47.95,28.3 47.95,29.52 48.56,30.12 49.33,30.12 50.39,31.19 50.39,31.5 50.7,31.8 54.36,31.8 55.73,30.43 69.75,30.43 70.05,30.73 71.73,30.73 72.34,30.12 v83.01,30.12 | v104.95,29.06 104.95,28.6 106.02,27.53 106.02,27.08 108.15,24.94 v112.72,24.94 | v115.32,22.35 117.14,20.52 117.14,20.07 117.75,19.46 127.97,19.46 v129.64,17.78 | v136.04,13.67 138.18,11.53 138.18,11.38 138.94,10.62 v154.48,10.62 | v170.33,22.5 175.21,27.38 175.21,28.3 175.51,28.6 181.61,28.6 L8.K
  Bottom 0.152: v83.01,30.12 84.38,30.12 85.29,29.21 94.13,29.21 94.74,29.82 104.19,29.82 v104.95,29.06 | v115.32,22.35 v112.72,24.94 | v129.64,17.78 131.93,17.78 v136.04,13.67 | v154.48,10.62 157.68,13.82 161.65,13.82 v170.33,22.5
N$25
  Top 0.152: 109.68,19.91 109.83,19.76 U$41.G 109.68,19.91 | 109.68,19.91 109.07,20.52 89.1,20.52 88.34,19.76 82.55,19.76 U$43.2 | 109.68,19.91 113.49,23.72 118.52,23.72 119.28,22.96 123.09,22.96 U$42.2
N$26
  Top 0.152: U$44.P10 151.44,25.4 149.76,27.08 149,27.08 145.64,30.43 140.46,30.43 138.94,28.91 138.94,26.16 129.64,16.87 116.69,16.87 115.01,18.54 113.49,18.54 112.42,19.61 U$41.D
N$27  (via drill 0.35)
  Top 0.152: v56.19,20.68 58.17,18.69 v75.54,18.69 | v90.93,17.78 94.74,13.97 100.08,13.97 100.38,14.28 100.38,16.26 100.84,16.71 v110.44,16.71 | v114.25,16.71 115.93,16.71 117.14,15.49 v120.5,15.49 | v133.6,14.28 139.09,14.28 142.14,11.23 147.47,11.23 149.15,12.9 v155.7,12.9 | v169.88,24.03 169.88,25.71 173.08,28.91 180.09,28.91 180.7,29.52 183.44,29.52 184.35,30.43 v186.94,30.43
  Bottom 0.152: v56.19,20.68 46.43,20.68 44.91,22.2 40.64,22.2 U$45.2 | v75.54,18.69 76,18.69 76.61,18.09 90.63,18.09 v90.93,17.78 | v114.25,16.71 v110.44,16.71 | v120.5,15.49 132.38,15.49 v133.6,14.28 | v155.7,12.9 156.31,12.9 157.53,14.12 159.97,14.12 v169.88,24.03 | v186.94,30.43 201.27,30.43 203.1,28.6 L9.K
N$28
  Top 0.152: U$4.P2 15.34,9.55 22.81,9.55 U$4.P9
N$29
  Top 0.152: U$9.P2 26.16,9.55 33.63,9.55 U$9.P9
N$30
  Top 0.152: U$14.P2 57.25,9.55 64.72,9.55 U$14.P9
N$31
  Top 0.152: U$19.P2 68.07,9.4 75.54,9.4 U$19.P9
N$32
  Top 0.152: U$24.P2 97.79,9.55 105.41,9.55 U$24.P9
N$33
  Top 0.152: U$44.P2 149.91,22.96 157.38,22.96 U$44.P9
N$34
  Top 0.152: U$39.P2 149.91,9.55 157.38,9.55 U$39.P9
N$35
  Top 0.152: U$34.P2 139.09,9.55 146.56,9.55 U$34.P9
N$36
  Top 0.152: U$29.P2 108.61,9.55 116.08,9.55 U$29.P9
N$37
  Top 0.152: U$4.P3 15.34,7.11 21.44,7.11 22.2,7.87 32.87,7.87 33.63,7.11 U$9.P8
N$38  (via drill 0.35)
  Top 0.152: v38.81,6.05 v36.83,6.05 | v59.54,6.96 64.72,6.96 U$14.P8
  Bottom 0.152: v36.83,6.05 36.68,6.2 36.68,7.11 35.92,7.87 33.02,7.87 32.26,7.11 26.16,7.11 U$9.P3 | v38.81,6.05 39.88,6.05 40.49,5.44 59.54,5.44 59.84,5.74 59.84,6.66 v59.54,6.96
N$39
  Top 0.152: U$14.P3 57.25,7.11 58.62,7.11 59.38,7.87 74.78,7.87 75.54,7.11 U$19.P8
N$40
  Bottom 0.152: U$19.P3 68.07,7.11 69.14,7.11 70.36,8.33 83.62,8.33 83.77,8.18 104.34,8.18 105.41,7.11 U$24.P8
N$41
  Bottom 0.152: U$34.P8 145.34,8.33 112.42,8.33 111.2,7.11 108.61,7.11 U$29.P3
N$42
  Top 0.152: U$34.P3 139.09,7.11 144.88,7.11 146.1,8.33 156.16,8.33 157.38,7.11 U$39.P8
N$43
  Bottom 0.152: U$44.P8 154.48,17.32 154.48,12.6 149.91,8.03 149.91,7.11 U$39.P3
N$44
  Bottom 0.152: U$4.P7 22.96,4.52 22.96,5.59 23.72,6.35 23.72,27.69 22.96,28.45 L1I.T
N$45
  Bottom 0.152: U$4.P8 22.81,7.11 22.81,8.03 20.22,10.62 20.22,23.11 19,24.33 19,27.23 17.78,28.45 INPUT.T
N$46
  Top 0.152: U$4.P4 15.19,4.52 15.19,5.44 14.43,6.2 14.43,15.34 24.64,25.55 33.78,25.55 35,26.77 35,27.84 34.39,28.45 L1O.T
N$47
  Bottom 0.152: U$29.P4 108.46,4.52 108.46,5.59 107.7,6.35 107.7,7.57 108.76,8.64 131.93,8.64 139.09,15.8 139.09,22.96 141.53,25.4 L6O.T
N$48
  Top 0.152: U$29.P7 116.23,4.52 116.53,4.52 117.75,5.74 126.14,5.74 132.84,12.45 132.84,19.61 141.53,28.3 141.53,29.21 L6I.T
N$49
  Top 0.152: U$34.P4 139.09,4.52 145.19,4.52 146.71,6.05 158.14,6.05 159.97,7.87 159.97,26.01 163.17,29.21 L7O.T
N$50
  Bottom 0.152: L7I.T 151.74,29.21 148.69,26.16 148.69,7.42 146.71,5.44 146.71,4.52 U$34.P7
N$51
  Top 0.152: L8O.T 185.42,28.75 160.88,4.22 160.58,4.22 159.97,3.61 156.77,3.61 156.01,4.37 149.91,4.37 U$39.P4
N$52
  Top 0.152: U$39.P7 157.53,4.52 160.73,4.52 176.43,20.22 176.43,27.23 L8I.T
N$53  (via drill 0.35)
  Top 0.152: v173.99,19.76 v161.19,19.76 | v180.39,19.15 181.46,19.15 182.52,20.22 185.42,20.22 194.41,29.21 L9I.T
  Bottom 0.152: U$44.P7 159.21,17.78 v161.19,19.76 | v173.99,19.76 178.41,19.76 179.02,19.15 v180.39,19.15
N$54  (via drill 0.35)
  Top 0.152: v161.8,21.89 162.71,21.89 163.63,20.98 173.23,20.98 173.99,21.74 v173.99,22.2 | v183.9,29.06 v177.04,22.2
  Bottom 0.152: v161.8,21.89 159.97,23.72 155.85,23.72 153.26,26.31 149.3,26.31 149,26.01 149,19.61 149.76,18.85 149.76,17.78 U$44.P4 | v177.04,22.2 v173.99,22.2 | v183.9,29.06 183.9,29.97 184.96,31.04 201.88,31.04 203.4,29.52 206.6,29.52 206.91,29.21 L9O.T
N$55  (via drill 0.35)
  Top 0.152: v133.45,18.39 136.19,21.13 146.56,21.13 147.32,20.37 149.76,20.37 U$44.P3 | v124.46,18.09 124.16,18.09 123.55,18.69 122.33,18.69 121.56,17.93 119.28,17.93 118.36,18.85 117.45,18.85 116.08,20.22 116.08,20.68 115.62,21.13 v112.42,21.13 | v109.68,21.13 103.43,27.38 v103.43,27.53 | v70.36,30.12 61.67,30.12 58.62,27.08 v51,27.08 | v34.39,27.08 31.95,27.08 30.73,25.86 20.98,25.86 20.83,26.01 19,26.01 17.78,24.79 OUTPUT.T
  Bottom 0.152: v133.45,18.39 124.77,18.39 v124.46,18.09 | v109.68,21.13 v112.42,21.13 | v103.43,27.53 102.97,27.53 102.82,27.38 97.03,27.38 96.88,27.53 83.92,27.53 81.33,30.12 76.15,30.12 75.84,29.82 70.66,29.82 v70.36,30.12 | v34.39,27.08 v51,27.08
N$56  (via drill 0.35)
  Top 0.152: v98.86,6.05 96.11,6.05 93.67,8.48 v93.67,10.01 | v105.41,24.33 v103.43,22.35
  Bottom 0.152: v98.86,6.05 100.38,4.52 105.41,4.52 U$24.P7 | v93.67,10.01 93.67,12.9 97.33,16.56 97.33,21.44 98.25,22.35 v103.43,22.35 | v105.41,24.33 105.41,24.64 109.22,28.45 L5I.T
N$57  (via drill 0.35)
  Top 0.152: v91.24,10.01 96.72,4.52 97.79,4.52 U$24.P4 | v96.72,16.87 97.94,16.87 99.31,18.24 v112.88,18.24 | v123.7,25.4 120.65,28.45 L5O.T
  Bottom 0.152: v91.24,10.01 91.24,11.07 96.72,16.56 v96.72,16.87 | v112.88,18.24 113.18,18.24 113.64,18.69 113.64,20.68 114.25,21.29 120.95,21.29 122.78,19.46 123.55,19.46 124.16,20.07 124.16,24.94 v123.7,25.4
N$58
  Bottom 0.152: U$19.P4 67.92,4.52 67.92,4.98 66.7,6.2 66.7,7.72 67.62,8.64 68.99,8.64 74.32,13.97 75.54,13.97 77.52,15.95 90.93,15.95 99.62,24.64 L4O.T
N$59  (via drill 0.35)
  Top 0.152: v65.94,4.98 65.63,5.28 64.11,5.28 63.35,4.52 57.25,4.52 U$14.P4 | v67.31,25.55 75.08,25.55 L3O.T
  Bottom 0.152: v65.94,4.98 65.94,14.58 67.31,15.95 v67.31,25.55
N$60
  Bottom 0.152: U$14.P7 64.87,4.52 64.87,5.59 65.63,6.35 65.63,14.73 66.55,15.65 66.55,28.45 L3I.T
N$61
  Top 0.152: L2I.T 39.12,27.69 39.12,9.25 34.39,4.52 33.78,4.52 U$9.P7
N$62
  Bottom 0.152: U$9.P4 26.01,4.52 26.01,5.44 25.09,6.35 25.09,25.71 28.91,29.52 31.04,29.52 37.14,23.42 47.19,23.42 47.95,22.66 50.09,22.66 55.88,28.45 L2O.T
N$63  (via drill 0.35)
  Top 0.152: v79.2,12.75 79.5,12.45 79.5,10.31 76.61,7.42 76.61,6.5 75.69,5.59 75.69,4.52 U$19.P7 | v89.56,19.61 v84.99,15.04 | v97.18,25.4 97.18,26.01 99.62,28.45 L4I.T
  Bottom 0.152: v79.2,12.75 80.42,13.97 81.94,13.97 82.25,13.67 83.62,13.67 v84.99,15.04 | v89.56,19.61 91.39,19.61 v97.18,25.4
N$64
  Top 0.152: HELD.P$1 224.13,22.35 223.67,22.35 222.61,23.42 214.99,23.42 213.92,22.35 213.92,21.74 213.16,20.98 212.24,20.98 211.33,21.89 211.33,23.27 211.18,23.42 203.25,23.42 201.42,21.59 R1.2
N$65
  Bottom 0.152: B1B.P$1 218.49,22.35 221.39,25.25 221.39,27.84 220.78,28.45 213.77,28.45 211.48,26.16 R7.2
N$66
  Top 0.152: R8.2 201.57,24.49 210.57,24.49 212.7,22.35 B2G.P$1
N$67
  Bottom 0.152: B3Y.P$1 206.91,22.35 206.45,22.35 202.18,26.62 193.8,26.62 R9.2
R5R6
  Top 0.152: U$29.P8 115.32,7.87 104.8,7.87 104.04,7.11 97.79,7.11 U$24.P3
RELAY1  (via drill 0.35)
  Top 0.152: v61.98,26.77 65.18,26.77 72.34,19.61 74.78,19.61 77.37,22.2 U$3.1 | v190.91,27.99 187.86,31.04 182.98,31.04 181.76,29.82 176.28,29.82 175.67,29.21 172.92,29.21 v166.22,22.5 | v155.4,15.65 153.57,15.65 149.76,19.46 147.78,19.46 146.41,20.83 137.72,20.83 v137.41,20.52 | v134.52,23.42 129.95,23.42 124.46,28.91 124.46,29.06 v123.39,30.12
  Bottom 0.152: v61.98,26.77 56.95,31.8 50.7,31.8 49.94,31.04 49.94,30.73 49.33,30.12 48.11,30.12 46.43,31.8 30.58,31.8 29.97,31.19 L1.A | v190.91,27.99 201.27,27.99 204.47,24.79 206.15,24.79 208.13,22.81 208.13,22.05 210.72,19.46 210.72,17.78 U1.20 | v166.22,22.5 166.22,20.83 159.82,14.43 156.62,14.43 v155.4,15.65 | v134.52,23.42 v137.41,20.52 | v123.39,30.12 119.58,30.12 119.28,30.43 116.84,30.43 116.53,30.12 115.77,30.12 115.47,30.43 107.24,30.43 103.73,26.92 97.48,26.92 96.88,26.31 87.12,26.31 83.92,23.11 78.28,23.11 77.52,22.35 U$3.1
RELAY2  (via drill 0.35)
  Top 0.152: L2.A 48.87,31.19 48.26,31.8 44.45,31.8 44.14,31.5 44.14,28.45 39.42,23.72 39.42,4.37 40.18,3.61 76.3,3.61 77.06,4.37 77.37,4.37 U$8.1 77.52,4.52 80.42,7.42 80.42,12.6 80.72,12.9 v80.72,13.36 | U1.21 207.21,17.78 206.15,18.85 195.17,18.85 194.11,17.78 194.11,17.32 192.58,15.8 182.07,15.8 179.78,18.09 179.78,19.46 v181.15,20.83 | v156.16,24.79 154.79,24.79 153.72,23.72 139.85,23.72 137.57,21.44 v135.59,21.44 | v121.26,18.54 119.13,18.54 118.52,19.15 117.6,19.15 116.38,20.37 116.38,20.83 115.47,21.74 112.12,21.74 111.05,20.68 111.05,18.69 110.9,18.54 90.32,18.54 v85.14,13.36
  Bottom 0.152: v181.15,20.83 179.32,20.83 169.57,30.58 169.57,31.5 169.27,31.8 162.1,31.8 159.82,29.52 159.21,29.52 156.16,26.47 v156.16,24.79 | v135.59,21.44 132.54,21.44 129.79,18.69 121.41,18.69 v121.26,18.54 | v80.72,13.36 v85.14,13.36
RELAY3  (via drill 0.35)
  Top 0.152: v61.37,11.38 v60.15,10.16 | U1.22 204.62,17.78 197.76,10.92 v171.25,10.92 | v158.75,9.25 158.14,8.64 131.17,8.64 v130.56,9.25 | v126.59,9.25 126.14,9.25 124.31,11.07 114.4,11.07 114.25,10.92 110.29,10.92 109.53,11.68 109.53,12.6 108.15,13.97 v107.7,13.97 | v106.48,13.97 106.48,11.53 106.17,11.23 v99.01,11.23 | v89.71,9.4 83.16,2.85 78.44,2.85 77.52,1.93 U$13.1
  Bottom 0.152: v60.15,10.16 60.15,7.11 64.26,3 76,3 77.06,1.93 77.37,1.93 U$13.1 | v61.37,11.38 61.82,11.38 65.48,15.04 65.48,29.67 67.46,31.65 73.1,31.65 73.56,31.19 L3.A | v171.25,10.92 163.17,10.92 161.49,9.25 v158.75,9.25 | v126.59,9.25 v130.56,9.25 | v106.48,13.97 v107.7,13.97 | v99.01,11.23 95.81,11.23 93.98,9.4 v89.71,9.4
RELAY4  (via drill 0.35)
  Top 0.152: v74.02,17.17 74.47,17.17 75.69,15.95 77.37,15.95 79.81,13.51 79.81,10.16 77.52,7.87 77.52,7.11 U$18.1 | v86.36,26.47 91.69,31.8 94.59,31.8 95.2,31.19 L4.A | U1.23 202.18,17.78 195.94,11.53 v172.47,11.53 | v127.2,7.72 124.16,10.77 114.55,10.77 114.25,10.46 104.8,10.46 104.65,10.31 98.55,10.31 98.25,10.62 84.84,10.62 81.33,7.11 v81.33,6.96
  Bottom 0.152: v74.02,17.17 74.02,19.46 72.95,20.52 72.95,21.44 77.98,26.47 v86.36,26.47 | v172.47,11.53 172.47,11.23 170.18,8.94 159.36,8.94 158.29,7.87 153.11,7.87 150.52,5.28 149,5.28 147.32,3.61 131.32,3.61 v127.2,7.72 | v81.33,6.96 80.42,6.96 80.26,6.81 77.67,6.81 77.52,6.96 U$18.1
RELAY5  (via drill 0.35)
  Top 0.152: v94.59,16.26 97.79,16.26 99.16,17.63 v105.87,17.63 | v108.31,23.88 112.72,23.88 114.71,25.86 | 114.71,25.86 115.16,26.31 115.93,26.31 117.14,27.53 117.14,30.12 116.23,31.04 L5.A | v163.93,21.59 v172.92,21.59 | v158.14,27.38 149.61,27.38 v148.69,28.3 | 114.71,25.86 v114.86,25.71
  Bottom 0.152: v94.59,16.26 89.56,11.23 82.09,11.23 81.79,11.53 78.59,11.53 77.52,10.46 77.52,9.55 U$23.1 | v105.87,17.63 105.87,19.61 108.31,22.05 v108.31,23.88 | U1.24 199.59,17.78 198.53,16.71 192.58,16.71 191.52,17.78 191.52,18.24 189.53,20.22 178.87,20.22 177.5,21.59 v172.92,21.59 | v158.14,27.38 v163.93,21.59 | v148.69,28.3 145.03,28.3 144.73,27.99 140.16,27.99 138.63,29.52 136.96,29.52 135.89,28.45 135.89,27.08 135.59,26.77 131.93,26.77 131.62,27.08 129.64,27.08 128.88,26.31 121.72,26.31 121.11,25.71 v114.86,25.71
RELAY6  (via drill 0.35)
  Top 0.152: v106.63,27.38 115.16,27.38 v115.62,26.92 | U1.25 197,17.78 193.8,14.58 v174.9,14.58 | v161.34,28.3 161.04,27.99 161.04,27.84 160.73,27.53 158.9,27.53 158.44,27.99 149.91,27.99 v147.62,30.28
  Bottom 0.152: v106.63,27.38 105.56,26.31 102.06,26.31 100.99,25.25 100.99,23.72 100.84,23.57 99.01,23.57 88.19,12.75 84.84,12.75 84.68,12.9 82.09,12.9 81.33,12.14 77.52,12.14 U$28.1 | v115.62,26.92 128.42,26.92 132.38,30.89 132.38,31.5 132.69,31.8 137.11,31.8 L6.A 137.87,31.04 144.58,31.04 145.34,30.28 v147.62,30.28 | v174.9,14.58 173.69,14.58 170.94,17.32 170.94,23.88 166.83,27.99 161.65,27.99 v161.34,28.3
RELAY7  (via drill 0.35)
  Top 0.152: v86.21,15.34 86.67,15.34 90.93,19.61 v104.65,19.61 | v135.28,27.38 138.18,27.38 v138.33,27.23 | v172.16,18.39 163.93,18.39 v163.17,19.15
  Bottom 0.152: v86.21,15.34 85.9,15.65 82.4,15.65 81.48,14.73 77.52,14.73 U$33.1 | v104.65,19.61 104.65,22.66 106.32,24.33 106.32,24.79 107.85,26.31 121.26,26.31 121.56,26.62 128.73,26.62 129.49,27.38 v135.28,27.38 | v138.33,27.23 148.69,27.23 152.5,31.04 154.33,31.04 | 154.33,31.04 159.97,31.04 L7.A | U1.26 196.7,17.78 197.76,18.85 201.12,18.85 201.73,18.24 201.73,17.32 200.2,15.8 174.75,15.8 v172.16,18.39 | v163.17,19.15 163.17,21.44 160.43,24.18 155.85,24.18 154.33,25.71 154.33,31.04
RELAY8
  Top 0.152: U$38.1 77.52,17.17 81.33,20.98 89.71,20.98 98.55,29.82 102.82,29.82 105.41,27.23 105.41,25.86 108,23.27 112.57,23.27 114.4,25.09 115.16,25.09 118.36,28.3 118.36,30.12 120.04,31.8 135.74,31.8 137.41,30.12 139.7,30.12 140.46,30.89 158.9,30.89 159.66,30.12 161.34,30.12 163.02,31.8 181,31.8 181.61,31.19 L8.A
  Bottom 0.152: U1.27 193.04,19 181.61,30.43 L8.A
RELAY9  (via drill 0.35)
  Top 0.152: v118.97,29.82 122.17,29.82 123.09,30.73 123.7,30.73 128.88,25.55 128.88,24.94 129.79,24.03 v135.89,24.03 | v139.24,24.03 153.11,24.03 v153.42,24.33 | v162.56,21.13 163.02,21.13 163.47,20.68 v173.99,20.68 | L9.A 203.1,31.04 199.44,31.04 198.07,29.67 198.07,28.14 195.94,26.01 195.63,26.01 190.6,20.98 190.6,17.78 U1.28
  Bottom 0.152: v118.97,29.82 115.62,29.82 115.32,30.12 108,30.12 104.5,26.62 101.91,26.62 101.3,26.01 87.58,26.01 81.33,19.76 77.52,19.76 U$43.1 | v139.24,24.03 v135.89,24.03 | v153.42,24.33 154.48,24.33 157.68,21.13 v162.56,21.13 | v173.99,20.68 177.95,20.68 178.87,19.76 188.47,19.76 190.45,17.78 U1.28

### Text on the board
tNames: 100R | 220k | 5v | 100k | G | G | G | G | G | G | G | G | G | 5v | 5v | 5v | 5v | 5v | 5v | 5v | 5v | 9v